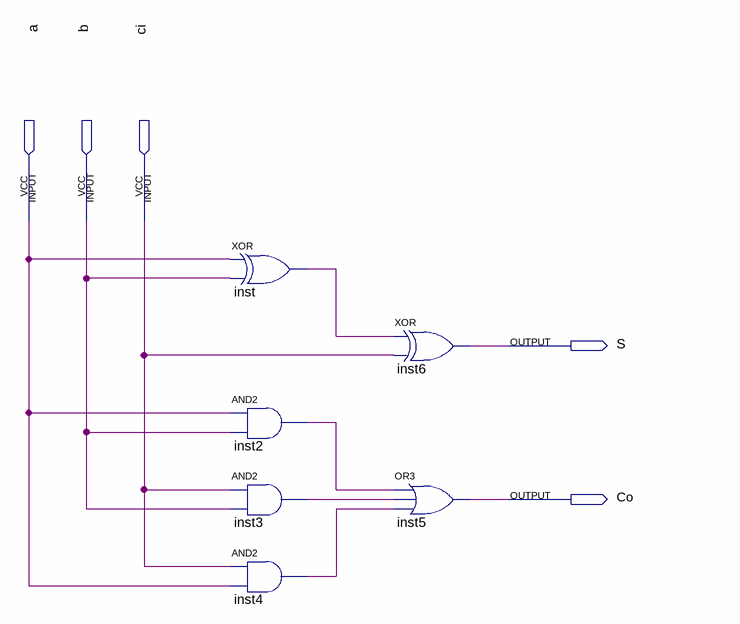
[diagram p0: schematic sheet]
// Quartus schematic FullAdder.bdf as structural Verilog: 6 symbols, 5 pins
module FullAdder (
  input  a,
  input  b,
  input  ci,
  output S,
  output Co
);

  wire inst2_out, inst3_out, inst4_out, inst_out;

  xor inst (inst_out, a, b);
  and inst2 (inst2_out, a, b);
  and inst3 (inst3_out, ci, b);
  and inst4 (inst4_out, ci, a);
  xor inst6 (S, inst_out, ci);
  or inst5 (Co, inst2_out, inst3_out, inst4_out);
endmodule
